# Altium schematic sheet FPGA - PERIPHERALS.SchDoc
size A3; DocumentNumber: 8; SheetNumber: 9; SheetTotal: 19
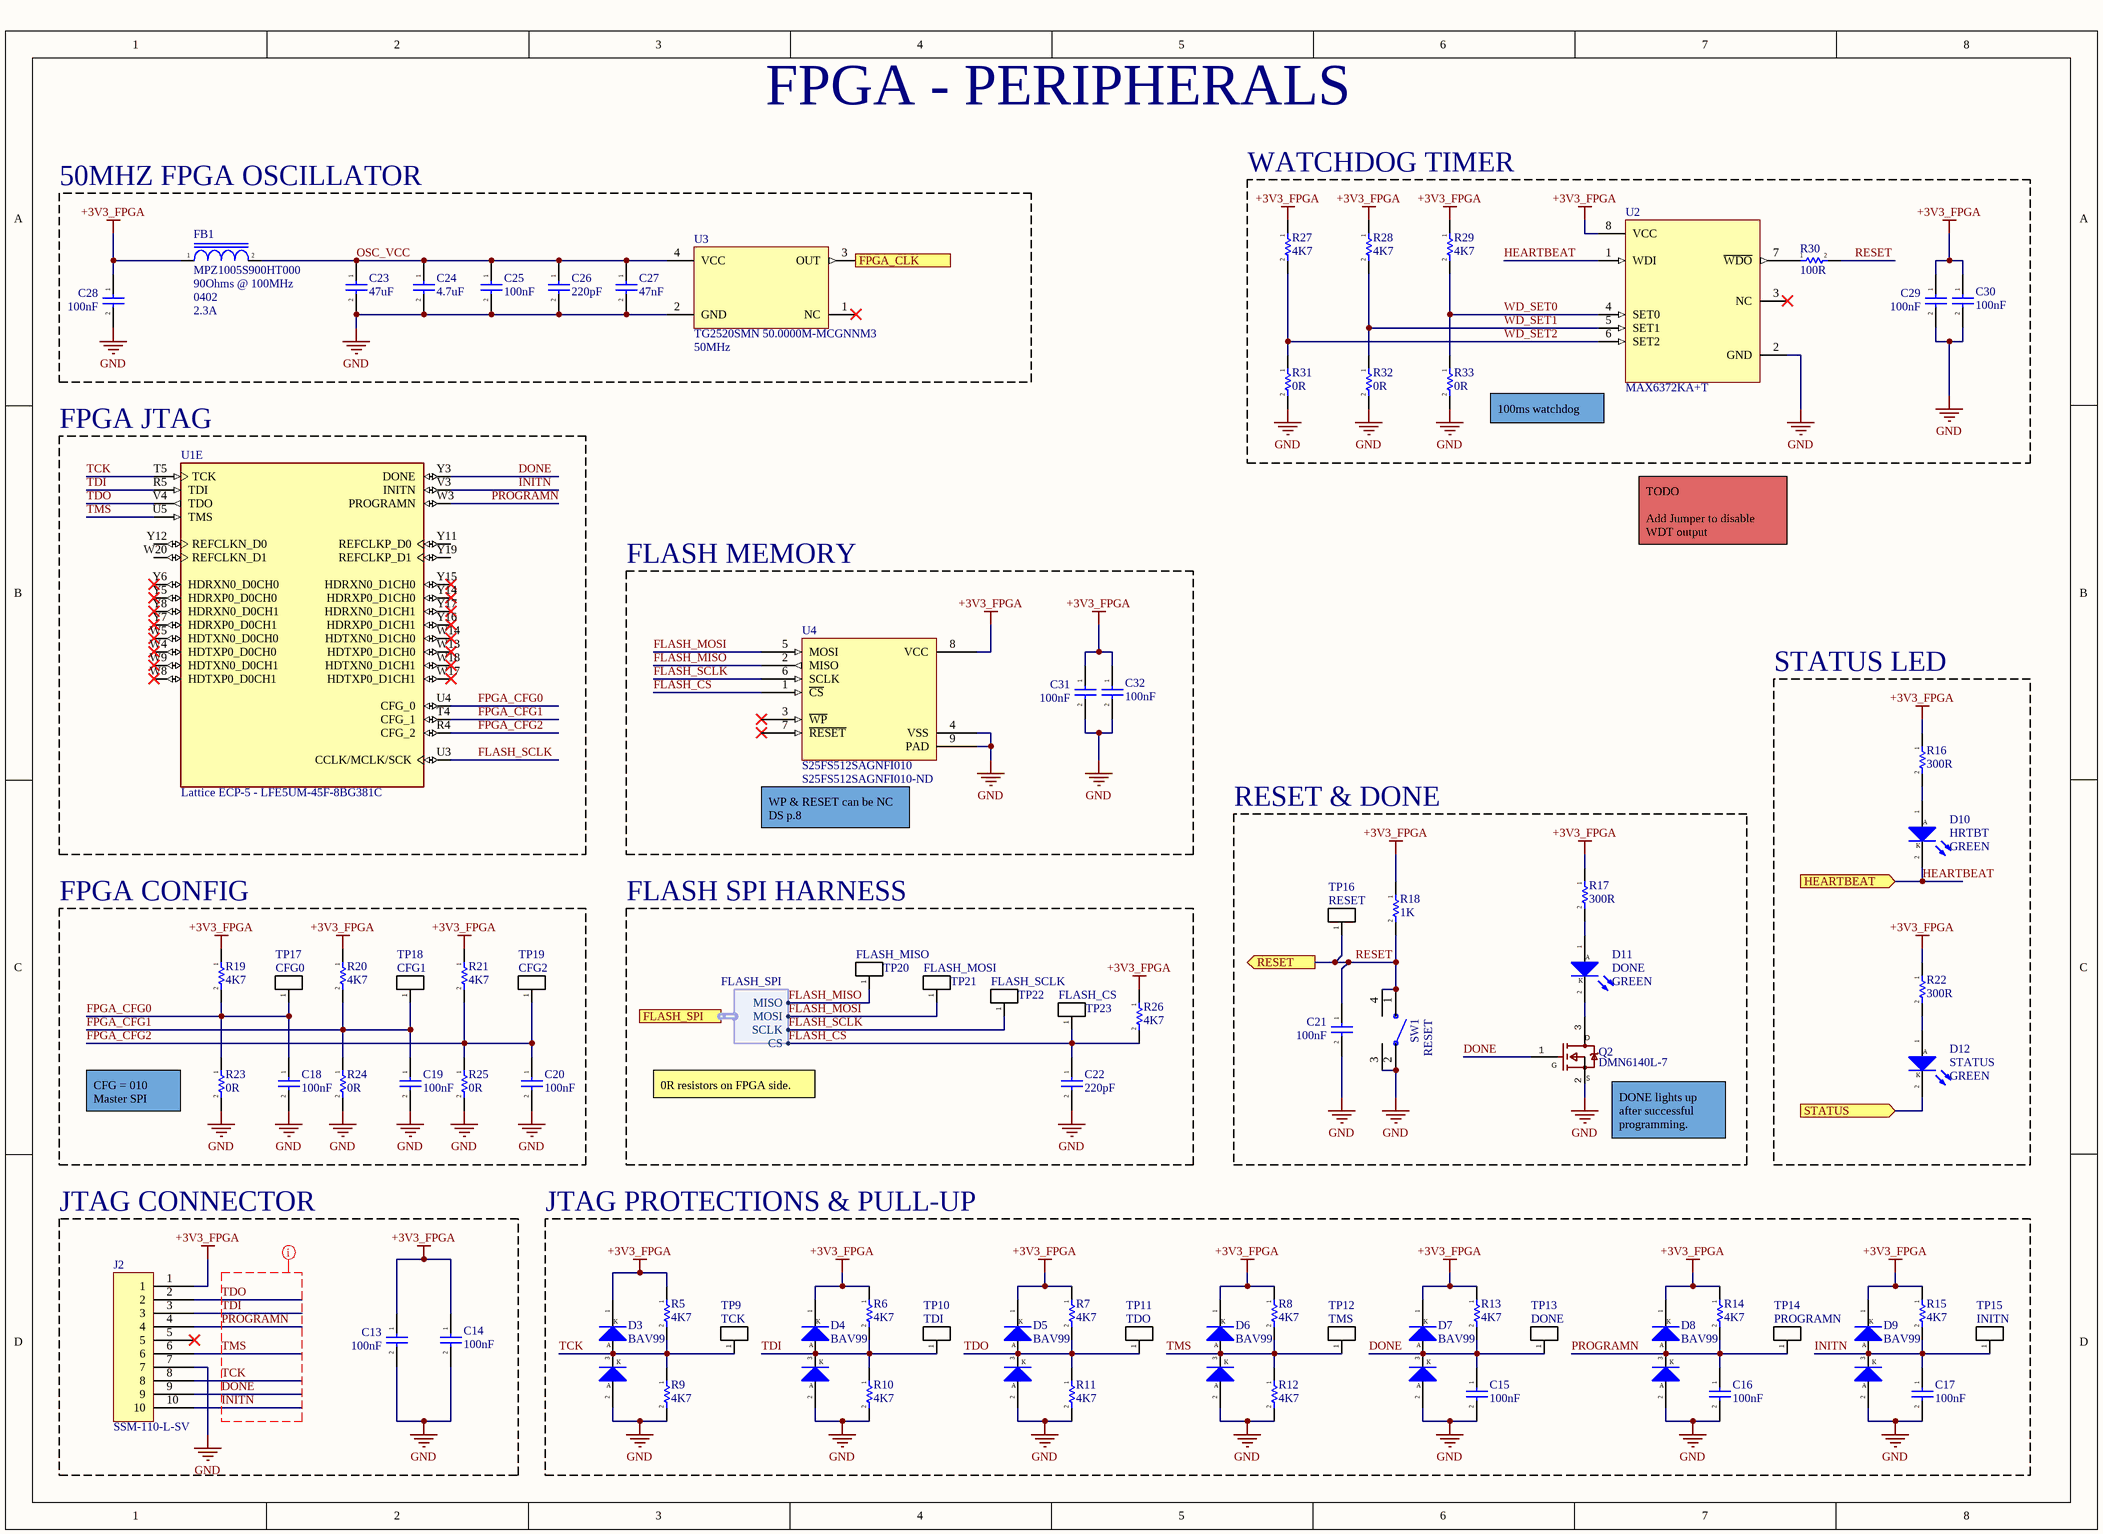
[diagram p0: FPGA - PERIPHERALS.SchDoc]

## Parts
C13  100nF  [CAP_0402]
C14  100nF  [CAP_0402]
C15  100nF  [CAP_0402]
C16  100nF  [CAP_0402]
C17  100nF  [CAP_0402]
C18  100nF  [CAP_0402]
C19  100nF  [CAP_0402]
C20  100nF  [CAP_0402]
C21  100nF  [CAP_0402]
C22  220pF  [CAP_0402]
C23  47uF  [CAP_1206]
C24  4.7uF  [CAP_0805]
C25  100nF  [CAP_0402]
C26  220pF  [CAP_0402]
C27  47nF  [CAP_0201]
C28  100nF  [CAP_0402]
C29  100nF  [CAP_0402]
C30  100nF  [CAP_0402]
C31  100nF  [CAP_0402]
C32  100nF  [CAP_0402]
D3  BAV99  [MMBD7000-7-F]
D4  BAV99  [MMBD7000-7-F]
D5  BAV99  [MMBD7000-7-F]
D6  BAV99  [MMBD7000-7-F]
D7  BAV99  [MMBD7000-7-F]
D8  BAV99  [MMBD7000-7-F]
D9  BAV99  [MMBD7000-7-F]
D10  HRTBT  Color: GREEN  [LED_0402]
D11  DONE  Color: GREEN  [LED_0402]
D12  STATUS  Color: GREEN  [LED_0402]
FB1  MPZ1005S900HT000  Impedance @ Freq: 90Ohms @ 100MHz  Package / Case: 0402  Current Rating: 2.3A  [IND_0402]
J2  SSM-110-L-SV  [SSM-110-L-SV]
Q2  DMN6140L-7  [SOT23-3]
R5  4K7  [RES_0603]
R6  4K7  [RES_0603]
R7  4K7  [RES_0603]
R8  4K7  [RES_0603]
R9  4K7  [RES_0603]
R10  4K7  [RES_0603]
R11  4K7  [RES_0603]
R12  4K7  [RES_0603]
R13  4K7  [RES_0603]
R14  4K7  [RES_0603]
R15  4K7  [RES_0603]
R16  300R  [RES_0603]
R17  300R  [RES_0603]
R18  1K  [RES_0603]
R19  4K7  [RES_0603]
R20  4K7  [RES_0603]
R21  4K7  [RES_0603]
R22  300R  [RES_0603]
R23  0R  [RES_0603]
R24  0R  [RES_0603]
R25  0R  [RES_0603]
R26  4K7  [RES_0603]
R27  4K7  [RES_0603]
R28  4K7  [RES_0603]
R29  4K7  [RES_0603]
R30  100R  [RES_0402]
R31  0R  [RES_0603]
R32  0R  [RES_0603]
R33  0R  [RES_0603]
SW1  RESET  [KMR621NGLFS]
TP9  TCK  [TP_PAD_SMALL]  (no BOM)
TP10  TDI  [TP_PAD_SMALL]  (no BOM)
TP11  TDO  [TP_PAD_SMALL]  (no BOM)
TP12  TMS  [TP_PAD_SMALL]  (no BOM)
TP13  DONE  [TP_PAD_TINY]  (no BOM)
TP14  PROGRAMN  [TP_PAD_TINY]  (no BOM)
TP15  INITN  [TP_PAD_TINY]  (no BOM)
TP16  RESET  [TP_PAD_SMALL]  (no BOM)
TP17  CFG0  [TP_PAD_TINY]  (no BOM)
TP18  CFG1  [TP_PAD_TINY]  (no BOM)
TP19  CFG2  [TP_PAD_TINY]  (no BOM)
TP20  FLASH_MISO  [TP_PAD_SMALL]  (no BOM)
TP21  FLASH_MOSI  [TP_PAD_SMALL]  (no BOM)
TP22  FLASH_SCLK  [TP_PAD_SMALL]  (no BOM)
TP23  FLASH_CS  [TP_PAD_SMALL]  (no BOM)
U1  Lattice ECP-5 - LFE5UM-45F-8BG381C  [CABGA-381]  (part E of 7)
U2  MAX6372KA+T  [SOT23-8]
U3  TG2520SMN 50.0000M-MCGNNM3  Frequency: 50MHz  [TG2520SMN]
U4  S25FS512SAGNFI010  Supplier Part Number 1: S25FS512SAGNFI010-ND  [s25FL256LAGNFV010]

## Blocks framed on the sheet
50MHZ FPGA OSCILLATOR: C23-C28 FB1 U3
WATCHDOG TIMER: C29 C30 R27-R33 U2
FPGA JTAG: U1
FLASH MEMORY: C31 C32 U4
STATUS LED: D10 D12 R16 R22
RESET & DONE: C21 D11 Q2 R17 R18 SW1 TP16
FPGA CONFIG: C18-C20 R19-R21 R23-R25 TP17-TP19
FLASH SPI HARNESS: C22 R26 TP20-TP23
JTAG CONNECTOR: C13 C14 J2
JTAG PROTECTIONS & PULL-UP: C15-C17 D3-D9 R5-R15 TP9-TP15

## Ports
FLASH_SPI (harness FLASH_SPI), FPGA_CLK (out), HEARTBEAT (in), RESET (out), STATUS (in)

## Harnesses
FLASH_SPI: MISO, MOSI, CS, SCLK

## Nets
+3V3_FPGA: C13.1 C14.1 C28.1 C29.1 C30.1 C31.1 C32.1 D3.1(K) D4.1(K) D5.1(K) D6.1(K) D7.1(K) D8.1(K) D9.1(K) FB1.1 J2.1 R5.1 R6.1 R7.1 R8.1 R13.1 R14.1 R15.1 R16.1 R17.1 R18.1 R19.1 R20.1 R21.1 R22.1 R26.1 R27.1 R28.1 R29.1 U2.8(VCC) U4.8(VCC)
GND: C13.2 C14.2 C15.2 C16.2 C17.2 C18.2 C19.2 C20.2 C21.2 C22.2 C23.2 C24.2 C25.2 C26.2 C27.2 C28.2 C29.2 C30.2 C31.2 C32.2 D3.2(K) D4.2(K) D5.2(K) D6.2(K) D7.2(K) D8.2(K) D9.2(K) J2.7 Q2.2 R9.2 R10.2 R11.2 R12.2 R23.2 R24.2 R25.2 R31.2 R32.2 R33.2 SW1.2 SW1.3 U2.2(GND) U3.2(GND) U4.4(VSS) U4.9(PAD)
DONE: C15.1 D7.3(A) J2.9 Q2.1 R13.2 TP13.1(A) U1.Y3(DONE)
FLASH_CS: C22.1 R26.2 TP23.1(A) U4.1(~{CS}) ; port FLASH_SPI.CS
FLASH_MISO: TP20.1(A) U4.2(MISO) ; port FLASH_SPI.MISO
FLASH_MOSI: TP21.1(A) U4.5(MOSI) ; port FLASH_SPI.MOSI
FLASH_SCLK: TP22.1(A) U1.U3(CCLK/MCLK/SCK) U4.6(SCLK) ; port FLASH_SPI.SCLK
FPGA_CFG0: C18.1 R19.2 R23.1 TP17.1(A) U1.U4(CFG_0)
FPGA_CFG1: C19.1 R20.2 R24.1 TP18.1(A) U1.T4(CFG_1)
FPGA_CFG2: C20.1 R21.2 R25.1 TP19.1(A) U1.R4(CFG_2)
FPGA_CLK: U3.3(OUT) ; port FPGA_CLK
HEARTBEAT: D10.2(K) U2.1(WDI) ; port HEARTBEAT
INITN: C17.1 D9.3(A) J2.10 R15.2 TP15.1(A) U1.V3(INITN)
OSC_VCC: C23.1 C24.1 C25.1 C26.1 C27.1 FB1.2 U3.4(VCC)
PROGRAMN: C16.1 D8.3(A) J2.4 R14.2 TP14.1(A) U1.W3(PROGRAMN)
RESET: C21.1 R18.2 R30.2 SW1.1 SW1.4 TP16.1(A) ; port RESET
STATUS: D12.2(K) ; port STATUS
TCK: D3.3(A) J2.8 R5.2 R9.1 TP9.1(A) U1.T5(TCK)
TDI: D4.3(A) J2.3 R6.2 R10.1 TP10.1(A) U1.R5(TDI)
TDO: D5.3(A) J2.2 R7.2 R11.1 TP11.1(A) U1.V4(TDO)
TMS: D6.3(A) J2.6 R8.2 R12.1 TP12.1(A) U1.U5(TMS)
WD_SET0: R29.2 R33.1 U2.4(SET0)
WD_SET1: R28.2 R32.1 U2.5(SET1)
WD_SET2: R27.2 R31.1 U2.6(SET2)
NetD10_1: D10.1(A) R16.2
NetD11_1: D11.1(A) R17.2
NetD11_2: D11.2(K) Q2.3
NetD12_1: D12.1(A) R22.2
NetR30_1: R30.1 U2.7(~{WDO})

Not connected (* = marked no-connect by the designer): J2 5*; U1 W4(HDTXP0_D0CH0)* W5(HDTXN0_D0CH0)* W8(HDTXP0_D0CH1)* W9(HDTXN0_D0CH1)* W13(HDTXP0_D1CH0)* W14(HDTXN0_D1CH0)* W17(HDTXP0_D1CH1)* W18(HDTXN0_D1CH1)* W20(REFCLKN_D1) Y5(HDRXP0_D0CH0)* Y6(HDRXN0_D0CH0)* Y7(HDRXP0_D0CH1)* Y8(HDRXN0_D0CH1)* Y11(REFCLKP_D0) Y12(REFCLKN_D0) Y14(HDRXP0_D1CH0)* Y15(HDRXN0_D1CH0)* Y16(HDRXP0_D1CH1)* Y17(HDRXN0_D1CH1)* Y19(REFCLKP_D1); U2 3(NC)*; U3 1(NC)*; U4 3(~{WP})* 7(~{RESET})*

## Layout directives
net class JTAG: DONE, INITN, PROGRAMN, TCK, TDI, TDO, TMS

## Notes on the sheet
- FPGA - PERIPHERALS
- 100ms watchdog
- TODO
  Add Jumper to disable WDT output
- (near U4) WP & RESET can be NC
  DS p.8
- (near R23) CFG = 010
  Master SPI
- 0R resistors on FPGA side.
- (near Q2) DONE lights up after successful programming.
- (in symbol TRANS_DMN6140L-7) D; G; S

## Library data of the parts
C13-C32 = CAP_CER: Generic SMT Ceramic Capacitor; Voltage - Rated: 25V; Operating Temperature: *; Tolerance: *; Mfr: *; ComponentLink1Description: Digikey; ComponentLink1URL: [Digikey Link]; Digikey Part No: *; ComponentLink2Description: Datasheet; ComponentLink2URL: [Datasheet Link]
  C13-C22 C25 C26 C28-C32: Footprint: 0402
  C23: Footprint: 1206
  C24: Footprint: 0805
  C27: Footprint: 0201
D3-D9 = DIODE_BAV99: DIODE ARRAY GP 75V 300MA SOT23-3; Mfr: Taiwan Semiconductor Corporation; Diode Configuration: 1 Pair Series Connection; Current: 200mA; DC Reverse Voltage: 70V; Operating Temperature: -55C - 150C; Footprint: SOT-23
D10-D12 = DIODE_LED: Generic LED; Forward Voltage: *; Wavelength: *
FB1 = IND_MPZ1005S900HT000: 90 Ohms @ 100 MHz 1 Power Line Ferrite Bead 0402 (1005 Metric) 2.3A 38mOhm; Resistance: 38mOhms; Operating Temperature: -55C - 125C; Rating: AEC-Q200
J2 = CONN_SSM-110-L-SV: CONN RCPT 10POS 0.1 GOLD SMD; Mfr: Samtec Inc.; Number of positions: 10; Pitch: 100mil; Current: 5.2A / contact; Insulation Height: 290mil; Operating Temperature: -55C - 125C; Supplier 1: Digi-Key; Supplier Part Number 1: SAM1148-10-ND
Q2 = TRANS_DMN6140L-7: N-Channel 60 V 1.6A (Ta) 700mW (Ta) Surface Mount SOT-23; Mfr: Diodes Incorporated; Vds: 60V; Rds ON: 140mR; Vgs: 3V; Package / Case: SOT-23; Operating Temperature: -55C - 150C; Current: 1.6A
R5-R15 R19-R21 R26-R29 = RESISTOR: Power: 1/16W; Tolerance: 10%; Automotive: *; Operating Temperature: *; # Digikey: *; ComponentLink1Description: Digikey; ComponentLink1URL: *; # Manufacturer: *; Package / Case: 0603
R16 R17 R22 = RESISTOR: Power: 1/8W; Tolerance: 2%; Automotive: *; Operating Temperature: *; # Digikey: *; ComponentLink1Description: Digikey; ComponentLink1URL: *; # Manufacturer: *; Package / Case: 0603
R18 = RESISTOR: Power: 1/8W; Tolerance: 5%; Automotive: *; Operating Temperature: *; # Digikey: *; ComponentLink1Description: Digikey; ComponentLink1URL: *; # Manufacturer: *; Package / Case: 0603
R23-R25 R30-R33 = RESISTOR: Power: 1/8W; Tolerance: 10%; Automotive: *; Operating Temperature: *; # Digikey: *; ComponentLink1Description: Digikey; ComponentLink1URL: *; # Manufacturer: *
  R23-R25 R31-R33: Package / Case: 0603
  R30: Package / Case: 0402
SW1 = SW_KMR621NG_LFS: Tactile Switch SPST-NO Top Actuated Surface Mount; Mfr: C&K; Alternative Part: KMR641NG ULC LFS; Contact Rating: 50mA @ 32V; Type: SPST-NO; Operating Temperature: -40C to 85C; Supplier 1: Newark; Supplier Part Number 1: 35AH0964; Digikey #: CKN10686CT-ND; ComponentLink1Description: Digikey; ComponentLink1URL: https://www.digikey.ca/en/products/detail/c-k/KMR641NG-ULC-LFS/6035352; ComponentLink2Description: Datasheet; ComponentLink2URL: https://www.ckswitches.com/media/1907/kmr6.pdf
TP9-TP23 = TESTPOINT: Test Point
U1 = IC_LFE5UM-45F-8BG381C: IC FPGA 203 I/O 381CABGA; Mfr: Lattice Semiconductors; Supply Voltage: 1.045V - 1.115V; LABs/CLBs: 11000; Logic Elements: 44000; IOs: 203; RAM Bits: 1990656; Operating Temperature: 0C - 85C; Package / Case: 381-CABGA
U2 = IC_MAX6372KA-T: Watchdog Push-Pull, Totem Pole 1 Channel SOT-23-8; Mfr: Maxim Integrated; Timeout: Adjustable 1ms - 10s; Temperature: -40C - 125C; Supplier 1: Mouser; ComponentLink1Description: Digikey; ComponentLink1URL: https://www.digikey.ca/en/products/detail/analog-devices-inc-maxim-integrated/MAX6372KA-T/1518602; ComponentLink2Description: Datasheet; ComponentLink2URL: https://datasheets.maximintegrated.com/en/ds/MAX6369-MAX6374.pdf; Supplier Part Number 1: 700-MAX6372KAT
U3 = IC_TG2520SMN_50.0000M-MCGNNM3: 50 MHz TCXO Clipped Sine Wave Oscillator 2.8V ~ 3.3V - 4-SMD, No Lead; Mfr: EPSON; Supply Voltage: 2.8V - 3.3V; Frequency Stability: 500ppb; Supply Current: 2mA; Type: TCXO; Operating Temperature: -40C to 85C; Supplier 1: Digi-Key; Supplier Part Number 1: 114-TG2520SMN50.0000M-MCGNNM3CT-ND; ComponentLink1Description: Digikey; ComponentLink1URL: https://www.digikey.ca/en/products/detail/epson/TG2520SMN-50-0000M-MCGNNM3/13151939; ComponentLink2Description: Datasheet; ComponentLink2URL: https://support.epson.biz/td/api/doc_check.php?dl=brief_TG2520SMN&lang=en; ComponentLink3Description: Manufacturer; ComponentLink3URL: https://www5.epsondevice.com/en/products/tcxo/tg2520smn.html
U4 = IC_S25FS512SAGNFI010: FLASH - NOR Memory IC 512Mb (64M x 8) SPI - Quad I/O, QPI 133 MHz 8-WSON (6x8); Mfr: Cypress; Memory Size: 512Mbits; Clock Frequency: 133MHz; Supply Voltage: 2.7V - 3.6V; Supplier 1: Digi-Key; Package: WSON-8 (8x6); Operating Temperature: -40C - 105C; ComponentLink1Description: Digikey; ComponentLink1URL: https://www.digikey.ca/en/products/detail/cypress-semiconductor-corp/S25FS512SAGNFI010/6596268; ComponentLink2Description: Datasheet; ComponentLink2URL: https://www.infineon.com/dgdl/Infineon-S25FS512S_512_Mb_1.8_V_Serial_Peripheral_Interface_with_Multi-I_O_Non-Volatile_Flash-DataSheet-v14_00-EN.pdf?fileId=8ac78c8c7d0d8da4017d0ed681a356fe&utm_source=cypress&utm_medium=referral&utm_campaign=202110_globe_en_all_integration-files